# Altium schematic sheet MCU.SchDoc
size A4
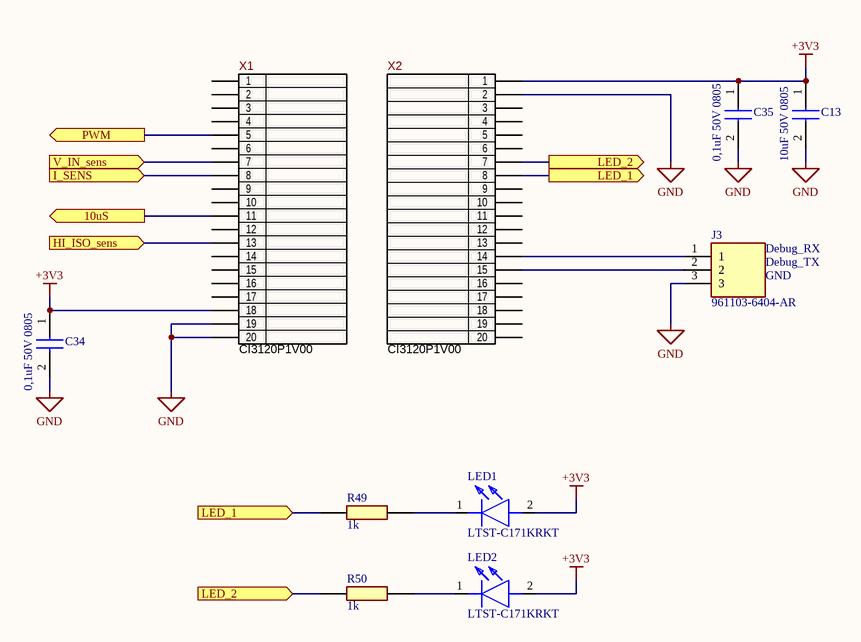
[diagram p0: MCU.SchDoc]

## Parts
C13  10uF 50V 0805  [CAPC2012X90N]
C34  0,1uF 50V 0805  [CAPC2012X90N]
C35  0,1uF 50V 0805  [CAPC2012X90N]
J3  961103-6404-AR  [HDRV3W64P0X254_1X3_762X250X1050P]
LED1  LTST-C171KRKT  [LEDM2012X90N]
LED2  LTST-C171KRKT  [LEDM2012X90N]
R49  1k  [RESC2013X65N]
R50  1k  [RESC2013X65N]
X1  Part Number: CI3120P1V00  [WF-20S]  (hidden comment: WH-20S)
X2  Part Number: CI3120P1V00  [WF-20S]  (hidden comment: WH-20S)

## Ports
10uS (out), HI_ISO_sens (in), I_SENS (in), LED_1 (in), LED_1 (out), LED_2 (in), LED_2 (out), PWM (out), V_IN_sens (in)

## Nets
+3V3: C13.1 C34.1 C35.1 LED1.2(A) LED2.2(A) X1.18 X2.1
GND: C13.2 C34.2 C35.2 J3.3 X1.19 X1.20 X2.2
10uS: X1.11 ; port 10uS
HI_ISO_sens: X1.13 ; port HI_ISO_sens
I_SENS: X1.8 ; port I_SENS
LED_1: R49.2 X2.8 ; port LED_1
LED_2: R50.2 X2.7 ; port LED_2
PWM: X1.5 ; port PWM
V_IN_sens: X1.7 ; port V_IN_sens
NetJ3_1: J3.1 X2.14
NetJ3_2: J3.2 X2.15
NetLED1_1: LED1.1(K) R49.1
NetLED2_1: LED2.1(K) R50.1

Not connected (* = marked no-connect by the designer): X1 1 2 3 4 6 9 10 12 14 15 16 17; X2 3 4 5 6 9 10 11 12 13 16 17 18 19 20

## Notes on the sheet
- Debug_TX
- Debug_RX
- GND

## Library data of the parts
C13 C34 C35 = MCMT21N470F250CT: Capacitor; Height: 0.9mm
J3 = 961103-6404-AR: Connector; Manufacturer_Name: 3M; Datasheet Link: https://datasheet.datasheetarchive.com/originals/distributors/Datasheets-DGA21/2082015.pdf; Height: 10.5mm; Manufacturer_Part_Number: 961103-6404-AR; Mouser Part Number: 517-9611036404AR; Mouser Price/Stock: https://www.mouser.co.uk/ProductDetail/3M-Electronic-Solutions-Division/961103-6404-AR?qs=A%252BtsDZJT%252Bi8c%252BGQWaXFlLA%3D%3D
LED1 LED2 = LTST-C171KRKT: LED; Manufacturer_Name: Lite-On; Datasheet Link: http://www.mouser.com/datasheet/2/239/Lite-On-LTST-C171KRKT-1175280.pdf; Height: 0.9mm; Manufacturer_Part_Number: LTST-C171KRKT; Mouser Part Number: 859-LTST-C171KRKT; Mouser Price/Stock: https://www.mouser.co.uk/ProductDetail/Lite-On/LTST-C171KRKT?qs=5XMAZBf2SiSTcAb1f5vDzw%3D%3D; Arrow Part Number: LTST-C171KRKT; Arrow Price/Stock: https://www.arrow.com/en/products/ltst-c171krkt/lite-on-technology?region=nac
R49 R50 = ERJP06J822V: Resistor; Height: 0.7mm
X1 X2 = CI3120P1V00: WH Series 2.54mm Wire to Board Straight DIP Type Headers, 20 Pin; Manufacturer: CviLux; Ajax_1C_PN: NONE; Ajax_1С_Status: RND Only; Part Type: Wire-to-Board / Header; Component Type: PTH; Temperature Range: -25℃ ~ 85℃; ComponentLink1URL: https://www.cvilux.com/uploads/drawings/100/723/CI3102S.pdf; Replacement: NONE; Price: NONE; ComponentLink1Description: Datasheet